# EasyEDA Pro project SmartHome-Voice-Assit.epro, schematic Schematic

## Sheets
1 MCU: Board Name: Board1; Create Date: 2025-05-22; Page Name: MCU; Project Name: ESP-Support; Schematic Name: Schematic1; Update Date: 2025-05-22; Company: 嘉立创EDA; Page Size: A4; Version: V1.0
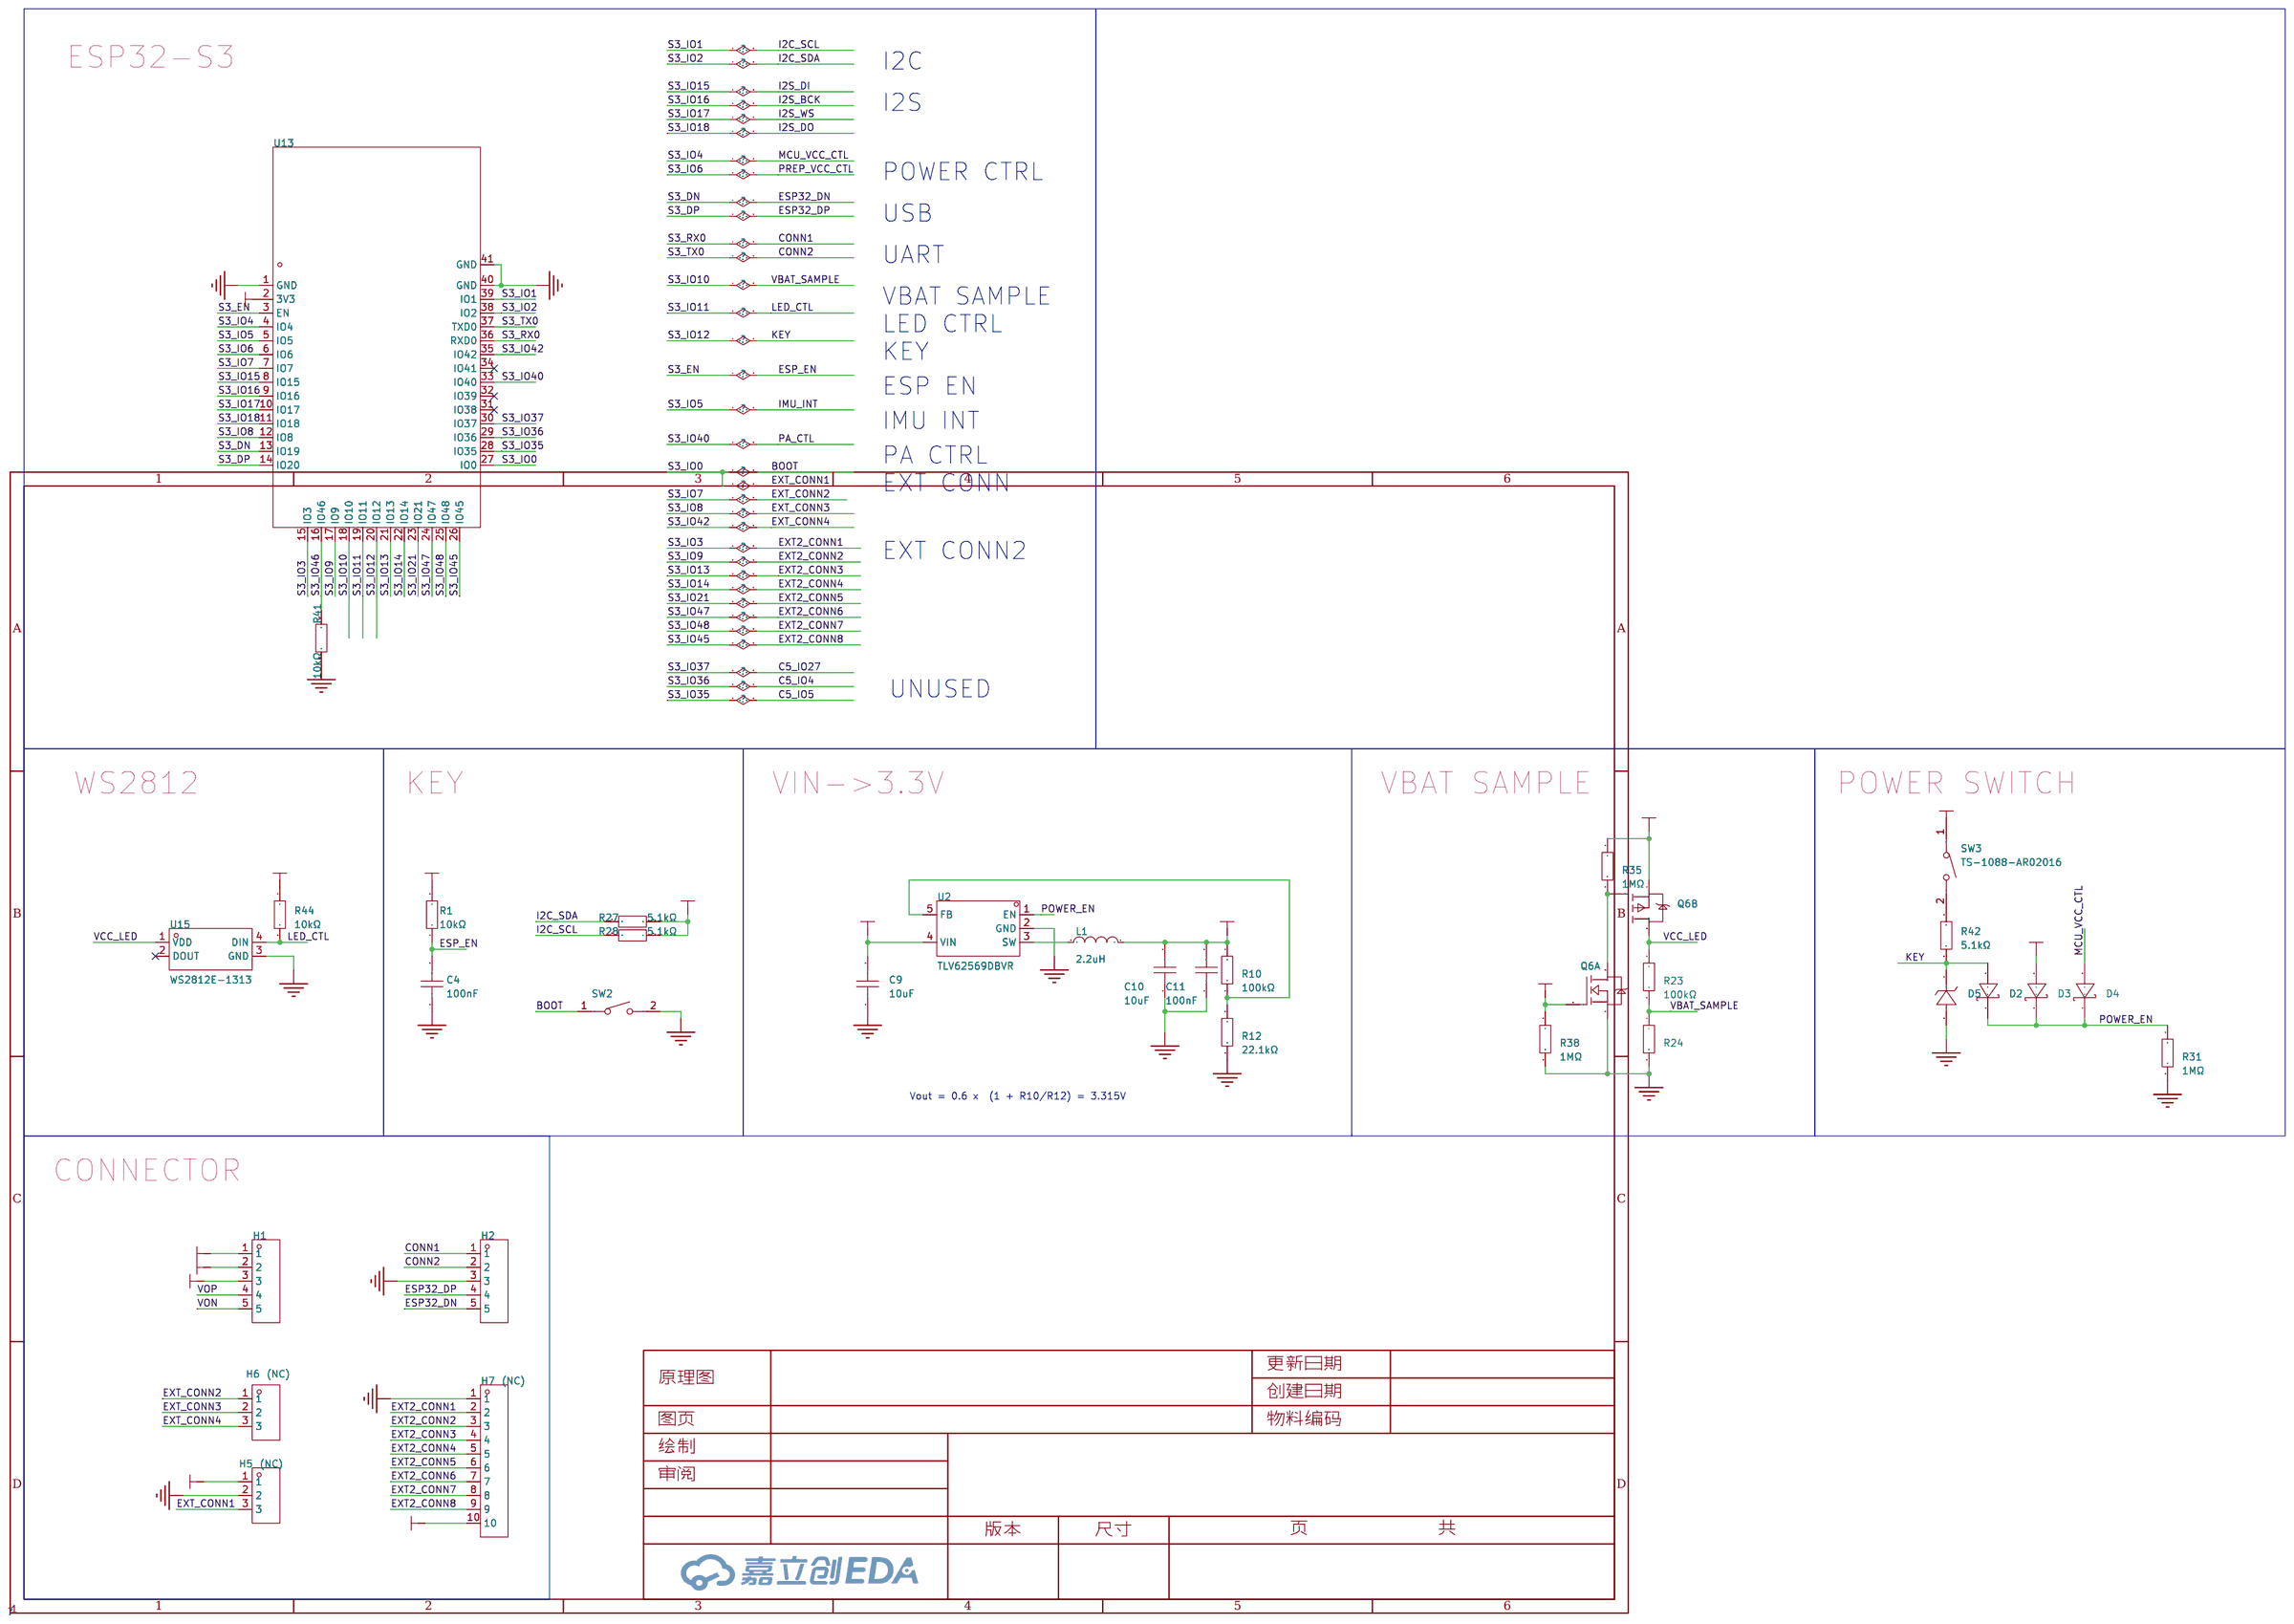
[diagram p1: MCU]
2 CODEC&IMU: Board Name: Main-Board; Create Date: 2025-05-28; Page Name: CODEC&IMU; Project Name: Dissertation-ESP32; Schematic Name: Schematic; Update Date: 2025-05-28
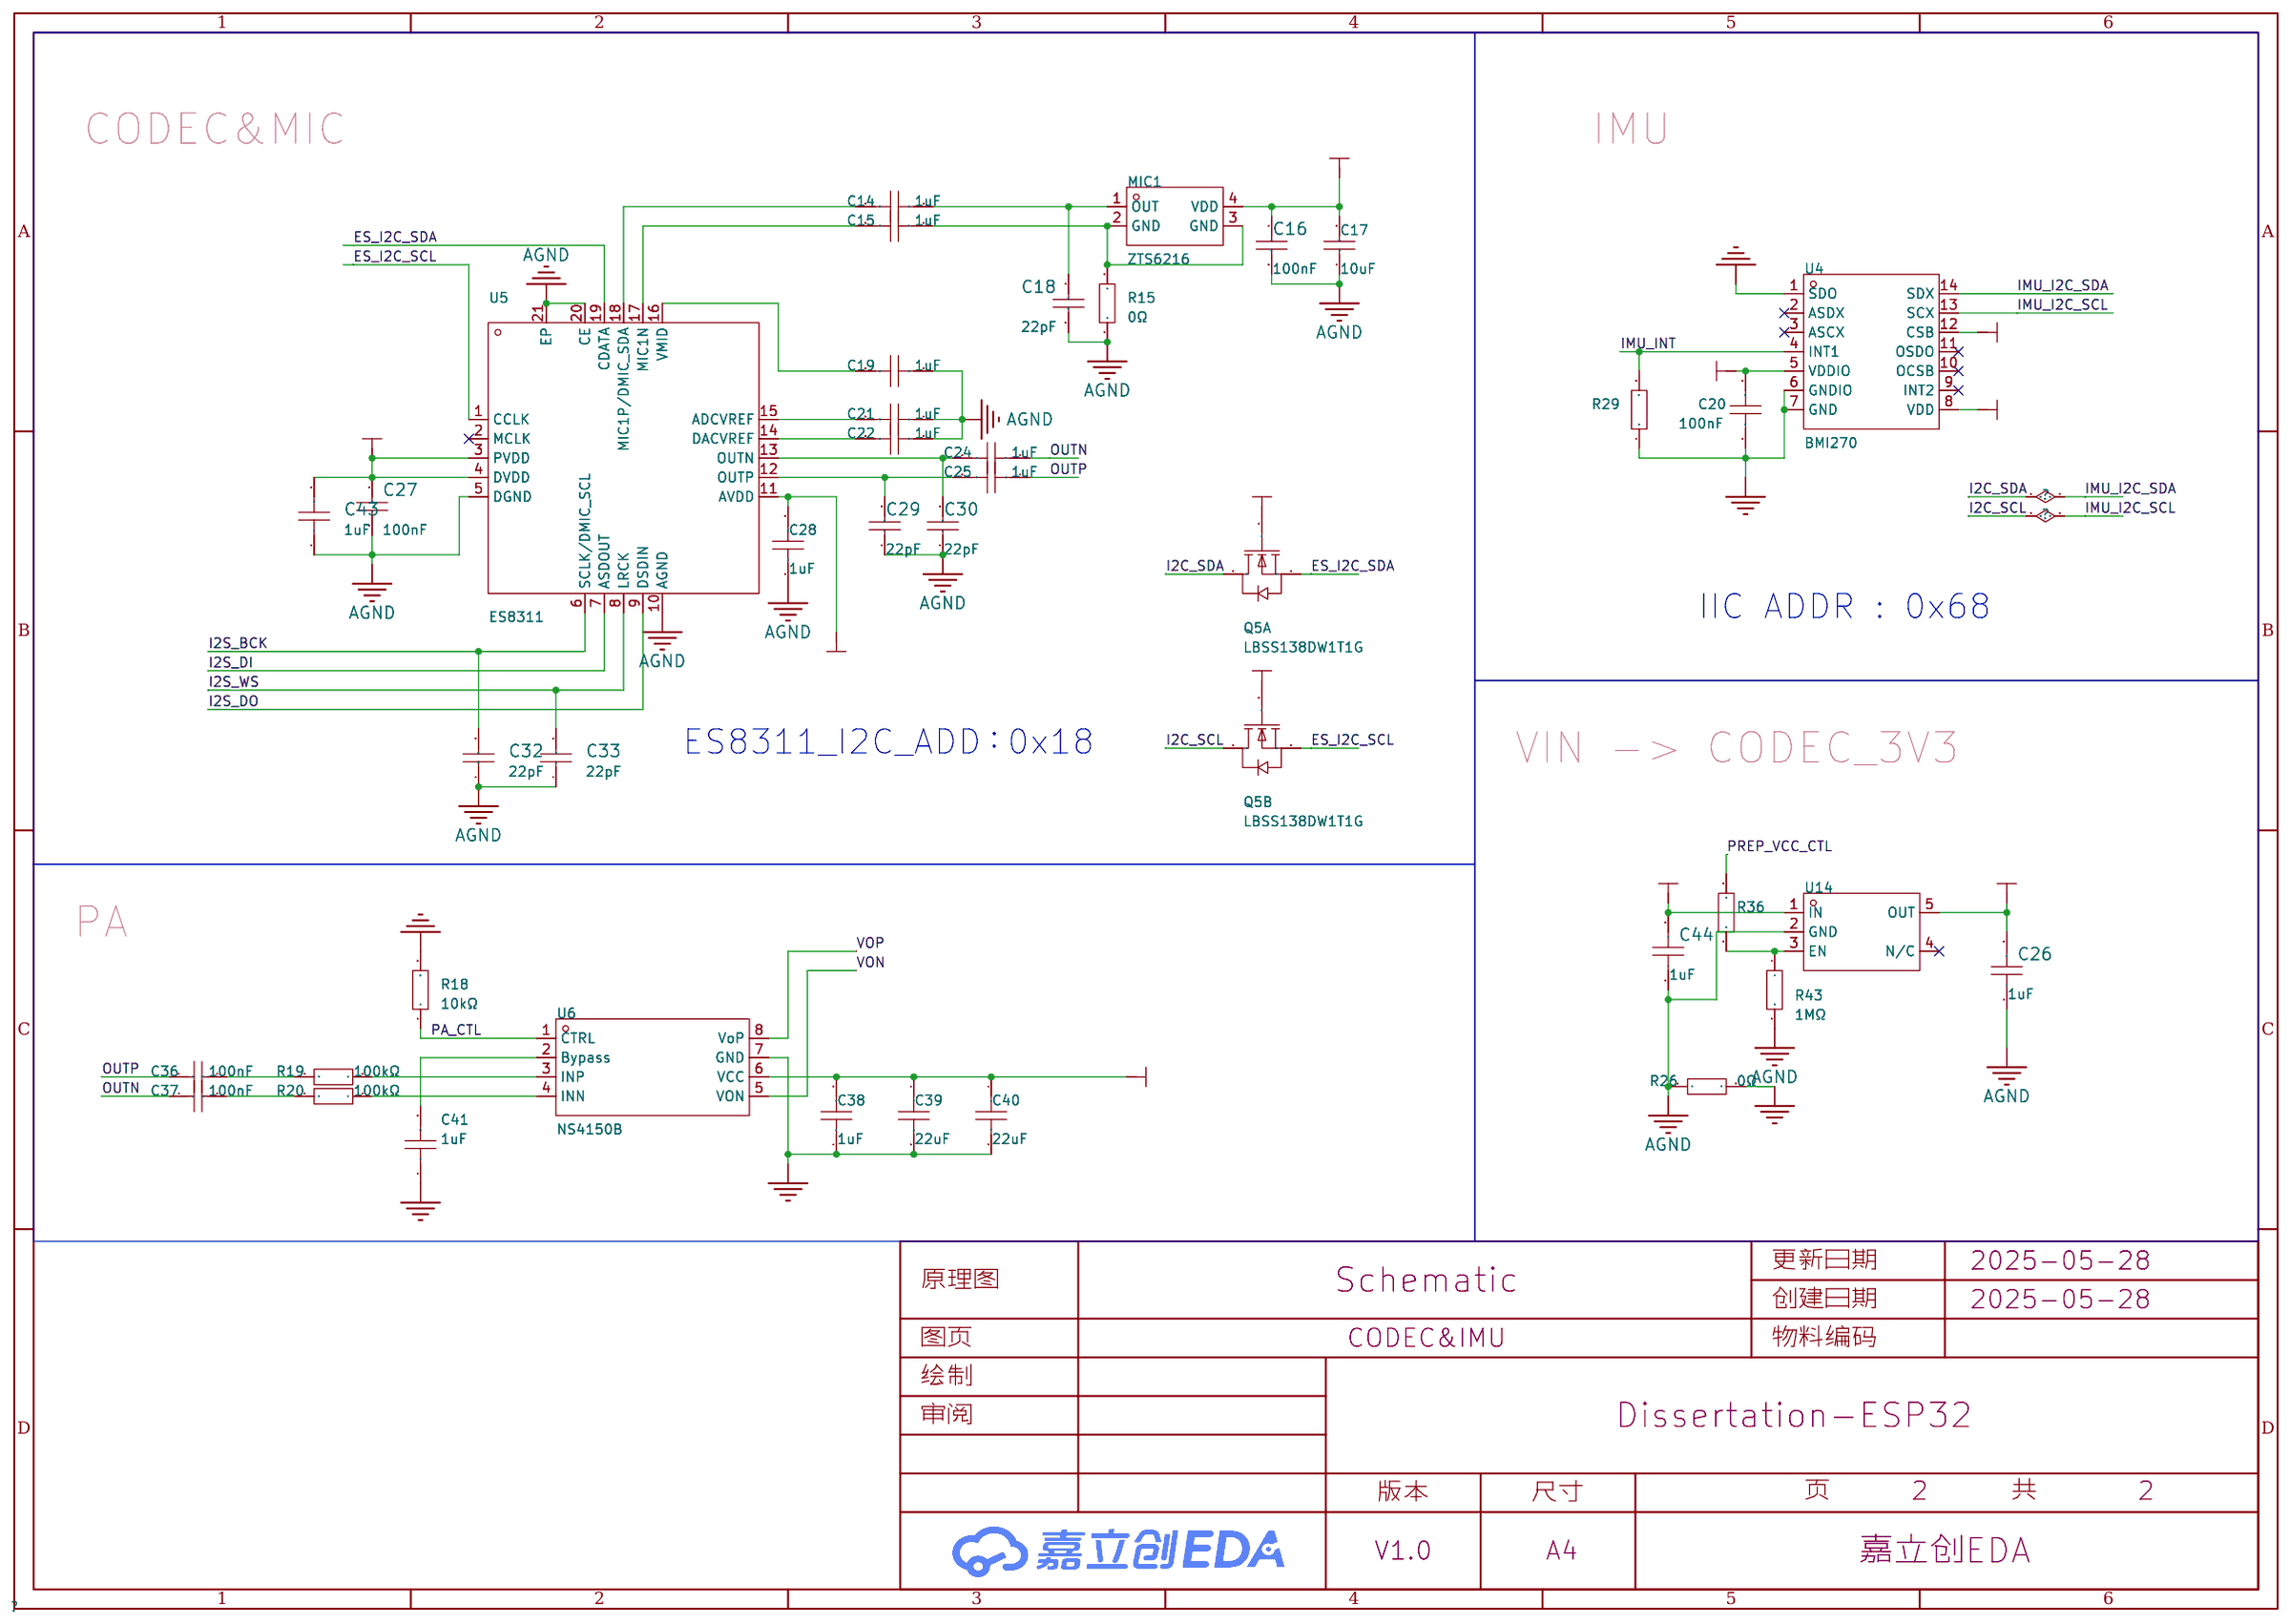
[diagram p2: CODEC&IMU]

## Parts
sheet CODEC&IMU
C14  1uF  [C0402]
C15  1uF  [C0402]
C16  100nF  [C0402]
C17  10uF  [C0402]
C18  22pF  [C0402]
C19  1uF  [C0402]
C20  100nF  [C0402]
C21  1uF  [C0402]
C22  1uF  [C0402]
C24  1uF  [C0402]
C25  1uF  [C0402]
C26  1uF  [C0402]
C27  100nF  [C0402]
C28  1uF  [C0402]
C29  22pF  [C0402]
C30  22pF  [C0402]
C32  22pF  [C0402]
C33  22pF  [C0402]
C36  100nF  [C0402]
C37  100nF  [C0402]
C38  1uF  [C0402]
C39  22uF  [C0603]
C40  22uF  [C0603]
C41  1uF  [C0402]
C43  1uF  [C0402]
C44  1uF  [C0402]
MIC1  ZTS6216  [MIC-SMD_4P-L2.8-W1.9-P1.84-TL]
Q5  LBSS138DW1T1G  [SC-88-6_L2.0-W1.3-P0.65-LS2.1-BL]  (sections 1,2)
R15  0Ω  [R0402]
R18  10kΩ  [R0402]
R19  100kΩ  [R0402]
R20  100kΩ  [R0402]
R26  0Ω  [R0402]
R29  100kΩ  [R0402]
R36  10kΩ  [R0402]
R43  1MΩ  [R0402]
U4  BMI270  [LGA-14_L3.0-W2.5-P0.50-BR]
U5  ES8311  [WQFN-20_L3.0-W3.0-P0.40-BL-EP1.7]
U6  NS4150B  [MSOP-8_L3.0-W3.0-P0.65-LS5.0-BL]
U14  LP5907MFX-3.3/NOPB  [SOT-23-5_L3.0-W1.7-P0.95-LS2.8-BR]
sheet MCU
C4  100nF  [C0402]
C9  10uF  [C0603]
C10  10uF  [C0603]
C11  100nF  [C0402]
D2  1N5819WS  [SOD-323_L1.8-W1.3-LS2.5-RD]
D3  1N5819WS  [SOD-323_L1.8-W1.3-LS2.5-RD]
D4  1N5819WS  [SOD-323_L1.8-W1.3-LS2.5-RD]
D5  BZT52C3V3S  [SOD-323_L1.7-W1.3-LS2.6-RD]
H1  PZ254V-11-05P  [HDR-TH_5P-P2.54-V-M]
H2  PZ254V-11-05P  [HDR-TH_5P-P2.54-V-M]
H5  (NC)  [HDR-TH_3P-P2.54-V-M]
H6  (NC)  [HDR-TH_3P-P2.54-V-M]
H7  (NC)  [HDR-TH_10P-P2.54-V-M]
L1  2.2uH  [IND-SMD_L2.5-W2.0_MHCHL2520]
Q6  CJ3439KDW  [SOT-363_L2.1-W1.3-P0.65-LS2.3-BL]  (sections 1,2)
R1  10kΩ  [R0402]
R10  100kΩ  [R0402]
R12  22.1kΩ  [R0402]
R23  100kΩ  [R0402]
R24  200kΩ  [R0402]
R27  5.1kΩ  [R0402]
R28  5.1kΩ  [R0402]
R31  1MΩ  [R0402]
R35  1MΩ  [R0402]
R38  1MΩ  [R0402]
R41  10kΩ  [R0402]
R42  5.1kΩ  [R0402]
R44  10kΩ  [R0402]
SW2  TS-1088-AR02016  [SW-SMD_L3.9-W3.0-P4.45]
SW3  TS-1088-AR02016  [SW-SMD_L3.9-W3.0-P4.45]
U2  TLV62569DBVR  [SOT-23-5_L3.0-W1.7-P0.95-LS2.8-BR]
U13  ESP32-S3-WROOM-1-N16R8  [WIRELM-SMD_ESP32-S3-WROOM-1]
U15  WS2812E-1313  [LED-SMD_4P-L1.3-W1.3-P0.80_WS2812E-1313]

## Library data of the parts
C14 C15 C19 C21 C22 C24 C25 C28 C38 C41 = CL05A105KA5NQNC: 容值:1uF;精度:±10%;额定电压:25V;材质(温度系数):X5R;; LCSC Part Name: 1uF ±10% 25V; Supplier Part: C52923; Manufacturer: SAMSUNG(三星); Supplier Footprint: 0402; Datasheet: https://atta.szlcsc.com/upload/public/pdf/source/20160103/1457707735223.pdf; Supplier: LCSC; Tolerance: ±10%; Voltage Rated: 25V; Temperature Coefficient: X5R; Check: true
C16 C27 = 0402B104K500NT: 温度系数:X7R;容值:100nF;精度:±10%;额定电压:50V;; LCSC Part Name: 100nF(104) ±10% 50V; Supplier Part: C110251; Manufacturer: FH(风华); Supplier Footprint: 0402; Supplier: LCSC; Temperature Coefficient: X7R; Tolerance: ±10%; Voltage Rated: 50V; Check: true
C17 = CL05A106MQ5NUNC: 容值:10uF;精度:±20%;额定电压:6.3V;材质(温度系数):X5R;; LCSC Part Name: 10uF ±20% 6.3V; Supplier Part: C15525; Manufacturer: SAMSUNG(三星); Supplier Footprint: 0402; JLCPCB Part Class: Basic Part; Datasheet: https://atta.szlcsc.com/upload/public/pdf/source/20220823/2B02EE04F8F211D38A52DCB16EB6BEBA.pdf; Supplier: LCSC; Tolerance: ±20%; Voltage Rated: 6.3V; Temperature Coefficient: X5R; Check: true
C18 C29 C30 C32 C33 = 0402CG220J500NT: 容值:22pF;精度:±5%;额定电压:50V;材质(温度系数):C0G;; LCSC Part Name: 22pF ±5% 50V; Supplier Part: C1555; Manufacturer: FH(风华); Supplier Footprint: 0402; Datasheet: https://atta.szlcsc.com/upload/public/pdf/source/20200305/C486355_26A10D38EF8C2A5C37091D0039909270.pdf; Supplier: LCSC; Tolerance: ±5%; Voltage Rated: 50V; Temperature Coefficient: C0G; Check: true
C4 C11 C20 = CL05B104KO5NNNC: 容值:100nF;精度:±10%;额定电压:16V;材质(温度系数):X7R;; LCSC Part Name: 100nF ±10% 16V; Supplier Part: C1525; Manufacturer: SAMSUNG(三星); Supplier Footprint: 0402; JLCPCB Part Class: 基础库; Datasheet: https://atta.szlcsc.com/upload/public/pdf/source/20160218/1457707763339.pdf; Supplier: LCSC; Tolerance: ±10%; Voltage Rated: 16V; Temperature Coefficient: X7R
C26 C43 C44 = CL05A105KA5NQNC: 容值:1uF;精度:±10%;额定电压:25V;材质(温度系数):X5R;; LCSC Part Name: 1uF ±10% 25V; Supplier Part: C52923; Manufacturer: SAMSUNG(三星); Supplier Footprint: 0402; JLCPCB Part Class: Basic Part; Datasheet: https://atta.szlcsc.com/upload/public/pdf/source/20160218/1457707763339.pdf; Supplier: LCSC; Tolerance: ±10%; Voltage Rated: 25V; Temperature Coefficient: X5R
C36 C37 = CL05B104KO5NNNC: 容值:100nF;精度:±10%;额定电压:16V;材质(温度系数):X7R;; LCSC Part Name: 100nF ±10% 16V; Supplier Part: C1525; Manufacturer: SAMSUNG(三星); Supplier Footprint: 0402; JLCPCB Part Class: 基础库; Datasheet: https://atta.szlcsc.com/upload/public/pdf/source/20160218/1457707763339.pdf; Supplier: LCSC; Tolerance: ±10%; Voltage Rated: 16V; Temperature Coefficient: X7R; Check: true
C39 C40 = CL10A226MO7JZNC: 容值:22uF;精度:±20%;额定电压:16V;材质(温度系数):X5R;; LCSC Part Name: 22uF ±20% 16V; Supplier Part: C2762594; Manufacturer: SAMSUNG(三星); Supplier Footprint: 0603; Datasheet: https://atta.szlcsc.com/upload/public/pdf/source/20220811/0832C3B1C642040B023B7A6186895861.pdf; Supplier: LCSC; Tolerance: ±20%; Voltage Rated: 16V; Temperature Coefficient: X5R; Check: true
MIC1 = ZTS6216: 方向:全指向;灵敏度:-38dB;信噪比:65dB;电流消耗:120uA;电源电压:1.5V~3.6V;阻抗:100Ω;; Supplier Part: C481302; Manufacturer: ZILLTEK(钰太); Supplier Footprint: SMD,2.75x1.85x1mm; Datasheet: https://atta.szlcsc.com/upload/public/pdf/source/20200316/C481302_3CBECE2A7DED4DFD53CEA082844189F4.pdf; Supplier: LCSC; Direction: 全指向; Sensitivity: -38dB; SNR(Signal to Noise Ratio): 65dB; Current Consumption: 120uA; Supply Voltage: 1.5V~3.6V; Impedance: 100Ω; Check: true
Q5 = LBSS138DW1T1G: 类型:2个N沟道;漏源电压(Vdss):50V;连续漏极电流(Id):200mA;导通电阻(RDS(on)@Vgs,Id):5.6Ω@2.75V,200mA;功率:225mW;阈值电压(Vgs(th)@Id):500mV@1mA;; LCSC Part Name: 2个N沟道 耐压:50V 电流:200mA; Supplier Part: C525406; Manufacturer: LRC(乐山无线电); Supplier Footprint: SC-88; JLCPCB Part Class: 扩展库; Datasheet: https://atta.szlcsc.com/upload/public/pdf/source/20200430/C525406_6366B5610902164BCE9580E47653FB6E.pdf; Supplier: LCSC; Type: 2个N沟道; Drain Source Voltage (Vdss): 50V; Continuous Drain Current (Id): 200mA; Drain Source On Resistance (RDS(on)@Vgs,Id): 5.6Ω@2.75V,200mA; Power Dissipation (Pd): 225mW; Gate Threshold Voltage (Vgs(th)@Id): 500mV@1mA; Input Capacitance (Ciss@Vds): 50pF@25V; Reverse Transfer Capacitance (Crss@Vds): 5pF@25V; Operating Temperature: -55℃~+150℃
R15 R26 = 0402WGF0000TCE: 电阻类型:厚膜电阻;阻值:0Ω;精度:±1%;功率:62.5mW;; LCSC Part Name: 0Ω ±1% 62.5mW; Supplier Part: C17168; Manufacturer: UNI-ROYAL(厚声); Supplier Footprint: 0402; Datasheet: https://atta.szlcsc.com/upload/public/pdf/source/20200306/C422600_1E6D84923E4A46A82E41ADD87F860B5C.pdf; Supplier: LCSC; Type: 厚膜电阻; Tolerance: ±1%; Power(Watts): 62.5mW; Temperature Coefficient: ±800ppm/℃; Overload Voltage (Max): 50V; Operating Temperature Range: -55℃~+155℃; Check: true
R18 = 0402WGF1002TCE: 电阻类型:厚膜电阻;阻值:10kΩ;精度:±1%;功率:62.5mW;温度系数:±100ppm/℃;; LCSC Part Name: 厚膜电阻 10kΩ ±1% 62.5mW; Supplier Part: C25744; Manufacturer: UNI-ROYAL(厚声); Supplier Footprint: 0402; Datasheet: https://atta.szlcsc.com/upload/public/pdf/source/20200306/C422600_1E6D84923E4A46A82E41ADD87F860B5C.pdf; Supplier: LCSC; Type: 厚膜电阻; Tolerance: ±1%; Power(Watts): 62.5mW; Temperature Coefficient: ±100ppm/℃; Overload Voltage (Max): 50V; Operating Temperature Range: -55℃~+155℃; Check: true
R19 R20 = 0402WGF1003TCE: 电阻类型:厚膜电阻;阻值:100kΩ;精度:±1%;功率:62.5mW;; LCSC Part Name: 100kΩ ±1% 62.5mW; Supplier Part: C25741; Manufacturer: UNI-ROYAL(厚声); Supplier Footprint: 0402; JLCPCB Part Class: 基础库; Datasheet: https://atta.szlcsc.com/upload/public/pdf/source/20200306/C422600_1E6D84923E4A46A82E41ADD87F860B5C.pdf; Supplier: LCSC; Type: 厚膜电阻; Tolerance: ±1%; Power(Watts): 62.5mW; Temperature Coefficient: ±100ppm/℃; Overload Voltage (Max): 50V; Operating Temperature Range: -55℃~+155℃; Check: true
R23 R29 = 0402WGF1003TCE: 电阻类型:厚膜电阻;阻值:100kΩ;精度:±1%;功率:62.5mW;最大工作电压:50V;温度系数:±100ppm/℃;; LCSC Part Name: 100kΩ ±1% 62.5mW 厚膜电阻; Supplier Part: C25741; Manufacturer: UNI-ROYAL(厚声); Supplier Footprint: 0402; JLCPCB Part Class: Basic Part; Datasheet: https://atta.szlcsc.com/upload/public/pdf/source/20200306/C422600_1E6D84923E4A46A82E41ADD87F860B5C.pdf; Supplier: LCSC; Type: 厚膜电阻; Tolerance: ±1%; Power(Watts): 62.5mW; Temperature Coefficient: ±100ppm/℃; Overload Voltage (Max): 50V; Operating Temperature Range: -55℃~+155℃
R36 = 0402WGF1002TCE: 电阻类型:厚膜电阻;阻值:10kΩ;精度:±1%;功率:62.5mW;最大工作电压:50V;温度系数:±100ppm/℃;; LCSC Part Name: 10kΩ ±1% 62.5mW 厚膜电阻; Supplier Part: C25744; Manufacturer: UNI-ROYAL(厚声); Supplier Footprint: 0402; JLCPCB Part Class: Basic Part; Datasheet: https://atta.szlcsc.com/upload/public/pdf/source/20200306/C422600_1E6D84923E4A46A82E41ADD87F860B5C.pdf; Supplier: LCSC; Type: 厚膜电阻; Tolerance: ±1%; Power(Watts): 62.5mW; Temperature Coefficient: ±100ppm/℃; Overload Voltage (Max): 50V; Operating Temperature Range: -55℃~+155℃
R31 R35 R38 R43 = 0402WGF1004TCE: 电阻类型:厚膜电阻;阻值:1MΩ;精度:±1%;功率:62.5mW;最大工作电压:50V;温度系数:±100ppm/℃;; LCSC Part Name: 1MΩ ±1% 62.5mW 厚膜电阻; Supplier Part: C26083; Manufacturer: UNI-ROYAL(厚声); Supplier Footprint: 0402; JLCPCB Part Class: Basic Part; Datasheet: https://atta.szlcsc.com/upload/public/pdf/source/20200306/C422600_1E6D84923E4A46A82E41ADD87F860B5C.pdf; Supplier: LCSC; Type: 厚膜电阻; Tolerance: ±1%; Power(Watts): 62.5mW; Overload Voltage (Max): 50V; Temperature Coefficient: ±100ppm/℃; Operating Temperature Range: -55℃~+155℃
U4 = BMI270: 传感器类型:加速度计陀螺仪;; Supplier Part: C2836813; Manufacturer: Bosch(博世); Supplier Footprint: LGA-14(2.5x3); JLCPCB Part Class: 扩展库; Datasheet: https://atta.szlcsc.com/upload/public/pdf/source/20210625/C2836813_35E1F3F92097F45A3828DF13DDBA01A5.pdf; Supplier: LCSC; Sensor Type: 加速度计陀螺仪; Operating Temperature: -40℃~+85℃
U5 = ES8311: Supplier Part: C962342; Manufacturer: Everest-semi(顺芯); Supplier Footprint: WQFN-20-EP(3x3); JLCPCB Part Class: 扩展库; Datasheet: https://atta.szlcsc.com/upload/public/pdf/source/20210630/C962342_E665EAE7274179BC7C5A390EC8AC685C.pdf; Supplier: LCSC; Check: true
U6 = NS4150B_C189961: 功放类型:Class D;输出功率:3Wx1@4Ω;; Supplier Part: C189961; Manufacturer: Nsiway(纳芯威); Supplier Footprint: MSOP-8; Datasheet: https://atta.szlcsc.com/upload/public/pdf/source/20220916/DAE631F3909B9CBB38BDE76E3E6D5896.pdf; Supplier: LCSC; Type of Power Amplifier: Class D; Output Power: 3Wx1@4Ω; Supply Voltage: 3V~5.25V
U14 = LP5907MFX-3.3/NOPB: 输出类型:固定;最大输入电压:5.5V;输出电压:3.3V;输出电流:250mA;电源纹波抑制比(PSRR):90dB@(100Hz)；60dB@(100kHz);输出极性:正极;; LCSC Part Name: 具有低 IQ 和使能功能的 250mA、低噪声、高 PSRR、超低压降稳压器; Supplier Part: C80670; Manufacturer: TI(德州仪器); Supplier Footprint: SOT-23-5; JLCPCB Part Class: 扩展库; Datasheet: https://www.ti.com/cn/lit/gpn/lp5907; Supplier: LCSC; Output Type: 固定; Maximum Input Voltage: 5.5V; Output Voltage: 3.3V; Output Current: 250mA; Power Supply Rejection Ratio (PSRR): 90dB@(100Hz)；60dB@(100kHz); Dropout Voltage: 250mV@(250mA); standby current: 25uA; Feature: 防静电保护；短路保护；自动放电功能；低ESR；热保护(TSD)；欠压闭锁；带使能; Operating Temperature: -40℃~+125℃; Output Polarity: 正极; Number of Outputs: 1
C9 C10 = CL10A106KP8NNNC: 容值:10uF;精度:±10%;额定电压:10V;材质(温度系数):X5R;; LCSC Part Name: 10uF ±10% 10V; Supplier Part: C19702; Manufacturer: SAMSUNG(三星); Supplier Footprint: 0603; JLCPCB Part Class: Basic Part; Datasheet: https://atta.szlcsc.com/upload/public/pdf/source/20160218/1457707763339.pdf; Supplier: LCSC; Tolerance: ±10%; Voltage Rated: 10V; Temperature Coefficient: X5R
D2 D3 = 1N5819WS_C191023: 正向压降(Vf):600mV@1A;直流反向耐压(Vr):40V;整流电流:1A;; LCSC Part Name: 电压:40V 电流:1A; Supplier Part: C191023; Manufacturer: Hottech(合科泰); Supplier Footprint: SOD-323; JLCPCB Part Class: 基础库; Datasheet: https://atta.szlcsc.com/upload/public/pdf/source/20220428/3CB86FD8D28D653594B4E35F9D5AEFD9.pdf; Supplier: LCSC; Forward Voltage (Vf@If): 600mV@1A; Reverse Voltage (Vr): 40V; Rectified Current: 1A
D4 = 1N5819WS_C191023: 正向压降(Vf):600mV@1A;直流反向耐压(Vr):40V;整流电流:1A;; LCSC Part Name: 电压:40V 电流:1A; Supplier Part: C191023; Manufacturer: Hottech(合科泰); Supplier Footprint: SOD-323; JLCPCB Part Class: 基础库; Datasheet: https://atta.szlcsc.com/upload/public/pdf/source/20220428/3CB86FD8D28D653594B4E35F9D5AEFD9.pdf; Supplier: LCSC; Forward Voltage (Vf@If): 600mV@1A; Reverse Voltage (Vr): 40V; Rectified Current: 1A; Average Rectified Current (Io): 1A
D5 = BZT52C3V3S_C19077437: 二极管配置:独立式;稳压值(标称值):3.3V;稳压值(范围):3.1V~3.5V;功率(Pd):200mW;; Supplier Part: C19077437; Manufacturer: 宏迦橙; Supplier Footprint: SOD-323; JLCPCB Part Class: 扩展库; Datasheet: https://atta.szlcsc.com/upload/public/pdf/source/20231117/06CD1C2A69B3FFC97FEAE4263E1B2FE9.pdf; Supplier: LCSC; Diode Configuration: 独立式; Zener Voltage (Nom): 3.3V; Reverse Leakage Current (Ir): 5uA@1V; Zener Voltage (Range): 3.1V~3.5V; Power Dissipation: 200mW; Zener Impedance (Zzt): 95Ω
H1 H2 = PZ254V-11-05P: 插针结构:1x5P;间距:2.54mm;行距:-;圆针/方针:方针;安装类型:直插;排数:单排;总PIN位数:5P;额定电流:-;额定电压:-;配合针长度:6mm;塑高:2.5mm;端接针长度:3mm;触头材质:黄铜;触头镀层:-;工作温度范围:-40℃~+105℃;颜色:黑色;; LCSC Part Name: 间距:2.54mm 1x5P 直插 方针; Supplier Part: C492404; Manufacturer: XFCN(兴飞); Supplier Footprint: 插件,P=2.54mm; JLCPCB Part Class: Extended Part; Datasheet: https://atta.szlcsc.com/upload/public/pdf/source/20200309/C492404_E51533260F8710EFF5D4617281164C1D.pdf; Supplier: LCSC; Pin Structure: 1x5P; Pitch: 2.54mm; Circluar Pins/Square Pins: 方针; Mounting Type: 直插; Number of Rows: 单排; Number of Pins: 5P; Length of Mating Pin: 6mm; Insulation Height: 2.5mm; Length of End Connection Pin: 3mm; Contact Material: 黄铜; Operating Temperature Range: -40℃~+105℃; Color: 黑色
H5 H6 = PZ254V-11-03P: 插针结构:1x3P;间距:2.54mm;行距:-;圆针/方针:方针;安装类型:直插;排数:单排;总PIN位数:3P;额定电流:3A;额定电压:250V;配合针长度:6mm;塑高:2.5mm;端接针长度:3mm;工作温度范围:-40℃~+105℃;颜色:黑色;; LCSC Part Name: 间距:2.54mm 1x3P 直插 方针; Supplier Part: C2937625; Manufacturer: XFCN(兴飞); Supplier Footprint: 插件,P=2.54mm; JLCPCB Part Class: Extended Part; Datasheet: https://atta.szlcsc.com/upload/public/pdf/source/20200309/C492402_8335C3D49C4E4C618838D59BB1D024C1.pdf; Supplier: LCSC; Pin Structure: 1x3P; Pitch: 2.54mm; Circluar Pins/Square Pins: 方针; Mounting Type: 直插; Number of Rows: 单排; Number of Pins: 3P; Current Rating (Max): 3A; Voltage Rating (Max): 250V; Length of Mating Pin: 6mm; Insulation Height: 2.5mm; Length of End Connection Pin: 3mm; Operating Temperature Range: -40℃~+105℃; Color: 黑色
H7 = HC-PZ254-11.5L-1x10PZ: 插针结构:1x10P;间距:2.54mm;行距:-;圆针/方针:方针;排数:单排;总PIN位数:10P;额定电流:3A;额定电压:-;配合针长度:6mm;塑高:2.5mm;端接针长度:3mm;触头材质:黄铜;触头镀层:金;工作温度:-40℃~+105℃;颜色:黑色;; LCSC Part Name: 间距2.54mm 1x10Pin 直插 H2.5 L11.5; Supplier Part: C27985194; Manufacturer: HC(虹成电子); Supplier Footprint: 插件,P=2.54mm; JLCPCB Part Class: 扩展库; Datasheet: https://atta.szlcsc.com/upload/public/pdf/source/20250106/FEB3E250C67764D44E750E79B3A340C4.pdf; Supplier: LCSC; Pin Structure: 1x10P; Pitch: 2.54mm; Circluar Pins/Square Pins: 方针; Number of Rows: 单排; Number of Pins: 10P; Current Rating: 3A; Length of Mating Pin: 6mm; Insulation Height: 2.5mm; Length of End Connection Pin: 3mm; Contact Material: 黄铜; Contact Plating: 金; Operating Temperature: -40℃~+105℃; Color: 黑色
L1 = FTC252012S2R2MBCA: 电感值:2.2uH;精度:±20%;额定电流:3A;饱和电流(Isat):3.8A;类型:一体成型电感;; LCSC Part Name: 2.2uH ±20% 3.8A; Supplier Part: C5832372; Manufacturer: cjiang(长江微电); Supplier Footprint: 1008; JLCPCB Part Class: 扩展库; Datasheet: https://atta.szlcsc.com/upload/public/pdf/source/20230602/8FFEDA9C0247A92A0D4B67554BFE4091.pdf; Supplier: LCSC; Tolerance: ±20%; Rated Current: 3A; Saturation Current (Isat): 3.8A; DC Resistance (DCR): 55mΩ; Type: 一体成型电感
Q6 = CJ3439KDW: 类型:1个N沟道+1个P沟道;漏源电压(Vdss):20V;连续漏极电流(Id):660mA;导通电阻(RDS(on)@Vgs,Id):380mΩ@4.5V;功率(Pd):-;阈值电压(Vgs(th)@Id):350mV@250uA;; LCSC Part Name: 1个N沟道+1个P沟道 耐压:20V 电流:660mA; Supplier Part: C99824; Manufacturer: CJ(江苏长电/长晶); Supplier Footprint: SOT-363; JLCPCB Part Class: 扩展库; Datasheet: https://atta.szlcsc.com/upload/public/pdf/source/20180326/C99824_FFB735370D7D00507C48A0EA161AAA26.pdf; Supplier: LCSC; Type: 1个N沟道+1个P沟道; Drain Source Voltage (Vdss): 20V; Continuous Drain Current (Id): 660mA; Drain Source On Resistance (RDS(on)@Vgs,Id): 380mΩ@4.5V; Gate Threshold Voltage (Vgs(th)@Id): 350mV@250uA; Input Capacitance (Ciss@Vds): 120pF@20V; Reverse Transfer Capacitance (Crss@Vds): 15pF@20V; Operating Temperature: -55℃~+150℃
R1 R41 R44 = 0402WGF1002TCE: 电阻类型:厚膜电阻;阻值:10kΩ;精度:±1%;功率:62.5mW;最大工作电压:50V;温度系数:±100ppm/℃;; LCSC Part Name: 厚膜电阻 10kΩ ±1% 62.5mW; Supplier Part: C25744; Manufacturer: UNI-ROYAL(厚声); Supplier Footprint: 0402; JLCPCB Part Class: Basic Part; Datasheet: https://atta.szlcsc.com/upload/public/pdf/source/20200306/C422600_1E6D84923E4A46A82E41ADD87F860B5C.pdf; Supplier: LCSC; Type: 厚膜电阻; Tolerance: ±1%; Power(Watts): 62.5mW; Temperature Coefficient: ±100ppm/℃; Overload Voltage (Max): 50V; Operating Temperature Range: -55℃~+155℃
R10 = 0402WGF1003TCE: 电阻类型:厚膜电阻;阻值:100kΩ;精度:±1%;功率:62.5mW;; LCSC Part Name: 100kΩ ±1% 62.5mW; Supplier Part: C25741; Manufacturer: UNI-ROYAL(厚声); Supplier Footprint: 0402; JLCPCB Part Class: 基础库; Datasheet: https://atta.szlcsc.com/upload/public/pdf/source/20200306/C422600_1E6D84923E4A46A82E41ADD87F860B5C.pdf; Supplier: LCSC; Type: 厚膜电阻; Tolerance: ±1%; Power(Watts): 62.5mW; Temperature Coefficient: ±100ppm/℃; Overload Voltage (Max): 50V; Operating Temperature Range: -55℃~+155℃
R12 = 0402WGF2212TCE: 电阻类型:厚膜电阻;阻值:22.1kΩ;精度:±1%;功率:62.5mW;最大工作电压:50V;温度系数:±100ppm/℃;; LCSC Part Name: 22.1kΩ ±1% 62.5mW 厚膜电阻; Supplier Part: C43473; Manufacturer: UNI-ROYAL(厚声); Supplier Footprint: 0402; JLCPCB Part Class: Extended Part; Datasheet: https://atta.szlcsc.com/upload/public/pdf/source/20200306/C422600_1E6D84923E4A46A82E41ADD87F860B5C.pdf; Supplier: LCSC; Type: 厚膜电阻; Tolerance: ±1%; Power(Watts): 62.5mW; Overload Voltage (Max): 50V; Temperature Coefficient: ±100ppm/℃; Operating Temperature Range: -55℃~+155℃
R24 = 0402WGF2003TCE: 电阻类型:厚膜电阻;阻值:200kΩ;精度:±1%;功率:62.5mW;最大工作电压:50V;温度系数:±100ppm/℃;; LCSC Part Name: 200kΩ ±1% 62.5mW 厚膜电阻; Supplier Part: C25764; Manufacturer: UNI-ROYAL(厚声); Supplier Footprint: 0402; JLCPCB Part Class: Basic Part; Datasheet: https://atta.szlcsc.com/upload/public/pdf/source/20200306/C422600_1E6D84923E4A46A82E41ADD87F860B5C.pdf; Supplier: LCSC; Type: 厚膜电阻; Tolerance: ±1%; Power(Watts): 62.5mW; Overload Voltage (Max): 50V; Temperature Coefficient: ±100ppm/℃; Operating Temperature Range: -55℃~+155℃
R27 R28 R42 = 0402WGF5101TCE: 电阻类型:厚膜电阻;阻值:5.1kΩ;精度:±1%;功率:62.5mW;最大工作电压:50V;温度系数:±100ppm/℃;; LCSC Part Name: 5.1kΩ ±1% 62.5mW 厚膜电阻; Supplier Part: C25905; Manufacturer: UNI-ROYAL(厚声); Supplier Footprint: 0402; JLCPCB Part Class: Basic Part; Datasheet: https://atta.szlcsc.com/upload/public/pdf/source/20200306/C422600_1E6D84923E4A46A82E41ADD87F860B5C.pdf; Supplier: LCSC; Type: 厚膜电阻; Tolerance: ±1%; Power(Watts): 62.5mW; Overload Voltage (Max): 50V; Temperature Coefficient: ±100ppm/℃; Operating Temperature Range: -55℃~+155℃
SW2 SW3 = TS-1088-AR02016: 电路结构:单刀单掷;按钮形状:圆形按钮;作用力:160gf;安装方式:立贴;开关长度:4mm;开关宽度:3mm;开关高度:2mm;带支架:不带;触点电流:50mA;额定电压(DC):12V;绝缘电阻:100MΩ;机械寿命:10万次;; LCSC Part Name: 4*3*2mm 立贴 轻触开关; Supplier Part: C720477; Manufacturer: XUNPU(讯普); Supplier Footprint: SMD; JLCPCB Part Class: 扩展库; Datasheet: https://atta.szlcsc.com/upload/public/pdf/source/20200810/C720475_60D09DD6C54279ADDB2DC25100F1CC11.pdf; Supplier: LCSC; Circuit: 单刀单掷; Actuator Style: 圆形按钮; Operating Force: 160gf; Mounting Style: 立贴; Switch Length: 4mm; Switch Width: 3mm; Switch Height: 2mm; Strike Gundam: 不带; Contact Current: 50mA; Voltage Rating (DC): 12V; Insulation Resistance: 100MΩ; Actuator/Cap Color: 黑色; Pin Style: SMD接片; Mechanical Life: 10万次; Operating Temperature: -30℃~+80℃
U2 = TLV62569DBVR: 功能类型:降压型;输出类型:可调;输入电压:2.5V~5.5V;输出电压:600mV~5.5V;输出电流(最大值):2A;; Supplier Part: C141836; Manufacturer: TI(德州仪器); Supplier Footprint: SOT-23-5; JLCPCB Part Class: 扩展库; Datasheet: https://www.ti.com/cn/lit/gpn/tlv62569; Supplier: LCSC; Function: 降压型; Output Type: 可调; Input Voltage: 2.5V~5.5V; Output Voltage: 600mV~5.5V; Output Current (Max): 2A; Switching Frequency: 1.5MHz; Operating Temperature: -40℃~+125℃@(TJ); Synchronous Rectification: 是; Topology: 降压式; Switch tube (built-in/external): 内置
U13 = ESP32-S3-WROOM-1-N16R8: LCSC Part Name: 通用型Wi-Fi+低功耗蓝牙MCU模组; Supplier Part: C2913202; Manufacturer: ESPRESSIF(乐鑫); Supplier Footprint: SMD,18x25.5mm; JLCPCB Part Class: 扩展库; Datasheet: https://atta.szlcsc.com/upload/public/pdf/source/20220705/4E799F39581577F766659887F738A439.pdf; Supplier: LCSC
U15 = WS2812E-1313: SMD灯珠  小尺寸，高性价比; Supplier Part: C5446700; Manufacturer: worldsemi; Supplier Footprint: SMD1313; JLCPCB Part Class: 扩展库; Datasheet: https://atta.szlcsc.com/upload/public/pdf/source/20240229/B8051D75F82007E6B8E5AD9424D7210B.pdf; Supplier: LCSC

## Nets
3V3: C10.2 C11.2 C20.2 H5.1 L1.1 R1.2 R10.1 R27.2 R28.1 R44.1 U4.5(VDDIO) U4.8(VDD) U4.12(CSB) U13.2(3V3)
AGND: C16.2 C17.1 C18.1 C19.1 C21.1 C22.1 C26.1 C27.1 C28.1 C29.1 C30.1 C32.1 C33.1 C43.1 C44.1 R15.1 R26.1 R43.2 U5.5(DGND) U5.10(AGND) U5.20(CE) U5.21(EP) U14.2(GND)
GND: C4.1 C9.1 C10.1 C11.1 C20.1 C38.1 C39.2 C40.2 C41.1 D5.2(A) H2.3 H5.2 H7.1 Q6.1(S1) R12.2 R18.2 R24.2 R26.2 R29.1 R31.2 R38.2 R41.1 SW2.2 U2.2(GND) U4.1(SDO) U4.6(GNDIO) U4.7(GND) U6.7(GND) U13.1(GND) U13.40(GND) U13.41(GND) U15.3(GND)
VBAT: H1.1 Q6.4(S2) R35.1 SW3.1
VBUS: D3.2(A) H1.3
VCC_LED: Q6.3(D2) R23.1 U15.1(VDD)
VIN: C9.2 C38.2 C39.1 C40.1 C44.2 H1.2 H7.10 U2.4(VIN) U6.6(VCC) U14.1(IN)
BOOT: H5.3 SW2.1 U13.27(IO0)
C5_IO4: U13.29(IO36)
C5_IO5: U13.28(IO35)
C5_IO27: U13.30(IO37)
CODEC_3V3: C16.1 C17.2 C26.2 C27.2 C28.2 C43.2 MIC1.4(VDD) Q5.2(G) Q5.5(G) Q6.2(G1) R38.1 U5.3(PVDD) U5.4(DVDD) U5.11(AVDD) U14.5(OUT)
CONN1: H2.1 U13.36(RXD0)
CONN2: H2.2 U13.37(TXD0)
ES_I2C_SCL: Q5.4(S) U5.1(CCLK)
ES_I2C_SDA: Q5.1(S) U5.19(CDATA)
ESP32_DN: H2.5 U13.13(IO19)
ESP32_DP: H2.4 U13.14(IO20)
ESP_EN: C4.2 R1.1 U13.3(EN)
EXT2_CONN1: H7.2 U13.15(IO3)
EXT2_CONN2: H7.3 U13.17(IO9)
EXT2_CONN3: H7.4 U13.21(IO13)
EXT2_CONN4: H7.5 U13.22(IO14)
EXT2_CONN5: H7.6 U13.23(IO21)
EXT2_CONN6: H7.7 U13.24(IO47)
EXT2_CONN7: H7.8 U13.25(IO48)
EXT2_CONN8: H7.9 U13.26(IO45)
EXT_CONN2: H6.1 U13.7(IO7)
EXT_CONN3: H6.2 U13.12(IO8)
EXT_CONN4: H6.3 U13.35(IO42)
I2C_SCL: Q5.3(D) R28.2 U4.13(SCX) U13.39(IO1)
I2C_SDA: Q5.6(D) R27.1 U4.14(SDX) U13.38(IO2)
I2S_BCK: C32.2 U5.6(SCLK/DMIC_SCL) U13.9(IO16)
I2S_DI: U5.7(ASDOUT) U13.8(IO15)
I2S_DO: U5.9(DSDIN) U13.11(IO18)
I2S_WS: C33.2 U5.8(LRCK) U13.10(IO17)
IMU_INT: R29.2 U4.4(INT1) U13.5(IO5)
KEY: D2.2(A) D5.1(K) R42.2 U13.20(IO12)
LED_CTL: R44.2 U13.19(IO11) U15.4(DIN)
MCU_VCC_CTL: D4.2(A) U13.4(IO4)
OUTN: C24.1 C37.1
OUTP: C25.1 C36.1
PA_CTL: R18.1 U6.1(CTRL) U13.33(IO40)
POWER_EN: D2.1(K) D3.1(K) D4.1(K) R31.1 U2.1(EN)
PREP_VCC_CTL: R36.2 U13.6(IO6)
S3_IO10: R23.2 R24.1 U13.18(IO10)
S3_IO46: R41.2 U13.16(IO46)
VON: H1.5 U6.5(VON)
VOP: H1.4 U6.8(VoP)
$2N2825: L1.2 U2.3(SW)
$2N2826: R10.2 R12.1 U2.5(FB)
$2N27093: Q6.5(G2) Q6.6(D1) R35.2
$2N28112: R42.1 SW3.2
$3N889: R19.1 U6.3(INP)
$3N890: R20.1 U6.4(INN)
$3N893: C41.2 U6.2(Bypass)
$3N898: C36.2 R19.2
$3N899: C37.2 R20.2
$3N1850: C25.2 C29.2 U5.12(OUTP)
$3N1851: C24.2 C30.2 U5.13(OUTN)
$3N1859: C21.2 U5.15(ADCVREF)
$3N1860: C22.2 U5.14(DACVREF)
$3N1862: C19.2 U5.16(VMID)
$3N2186: C14.2 U5.18(MIC1P/DMIC_SDA)
$3N2191: C15.2 U5.17(MIC1N)
$3N2596: C14.1 C18.2 MIC1.1(OUT)
$3N2598: C15.1 MIC1.2(GND) MIC1.3(GND) R15.2
$3N16147: R36.1 R43.1 U14.3(EN)

Not connected (* = marked no-connect by the designer): U4 2(ASDX)* 3(ASCX)* 9(INT2)* 10(OCSB)* 11(OSDO)*; U5 2(MCLK)*; U13 31(IO38)* 32(IO39)* 34(IO41)*; U14 4(N/C)*; U15 2(DOUT)*

## Notes on the sheets
sheet 1
- ESP32-S3
- I2C
- I2S
- POWER CTRL
- USB
- UART
- VBAT SAMPLE
- LED CTRL
- KEY
- ESP EN
- IMU INT
- PA CTRL
- EXT CONN
- EXT CONN2
- UNUSED
- WS2812
- KEY
- VIN->3.3V
- VBAT SAMPLE
- POWER SWITCH
- Vout = 0.6 x  (1 + R10/R12) = 3.315V
- CONNECTOR
sheet 2
- CODEC&MIC
- IMU
- IIC ADDR : 0x68
- ES8311_I2C_ADD：0x18
- VIN -> CODEC_3V3
- PA
